# EAGLE design LightBox (EAGLE 9.2.2)
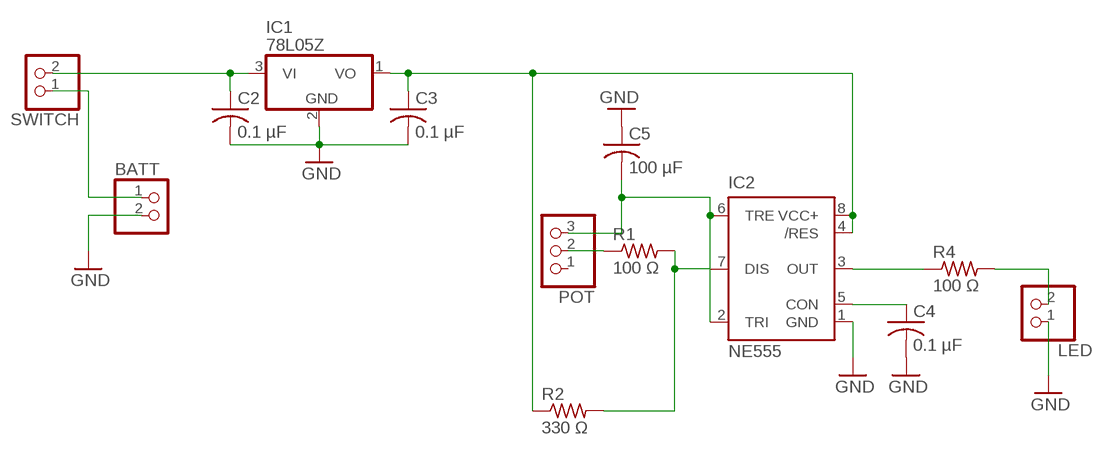
[diagram p0: schematic, sheet 1]

## Parts
BATT  PINHD-1X2  [1X02]
C2  0.1 µF  C-USC0805  [C0805]
C3  0.1 µF  C-USC0805  [C0805]
C4  0.1 µF  C-USC0805  [C0805]
C5  100 µF  C-US025-024X044  [C025-024X044]
IC1  78L05Z  [TO92]
IC2  NE555  [DIL-08]
LED  PINHD-1X2  [1X02]
POT  PINHD-1X3  [1X03]
R1  100 Ω  R-US_R0805  [R0805]
R2  330 Ω  R-US_R0805  [R0805]
R4  100 Ω  R-US_R0805  [R0805]
SWITCH  PINHD-1X2  [1X02]

## Nets
GND: BATT.2 C2.2 C3.2 C4.2 C5.1 IC1.2(GND) IC2.1(GND) LED.1
N$1: C5.2 IC2.2(TRI) IC2.6(TRE) POT.3
N$2: IC2.7(DIS) R1.2 R2.2
N$3: IC2.3(OUT) R4.1
N$4: LED.2 R4.2
N$5: C2.1 IC1.3(VI) SWITCH.2
N$6: C4.1 IC2.5(CON)
N$7: BATT.1 SWITCH.1
N$8: C3.1 IC1.1(VO) IC2.4(/RES) IC2.8(VCC+) R2.1
N$9: POT.2 R1.1
Unconnected: POT.1

## Library data of the parts
BATT LED SWITCH = pinhead:PINHD-1X2: PIN HEADER
C2-C5 = rcl:C-US: CAPACITOR, American symbol; SPICEPREFIX: C
IC1 = linear:78*: Positive VOLTAGE REGULATOR Source: http://cache.national.com/ds/LM/LM78L05.pdf http://www.fairchildsemi.com/ds/LM/LM7805.pdf
IC2 = st-microelectronics:NE555: General purpose bipolar Timer; MF: Arrow Electronics; MPN: NE555N; OC_FARNELL: 1467742; OC_NEWARK: 89K1486
POT = pinhead:PINHD-1X3: PIN HEADER
R1 R2 R4 = rcl:R-US_: RESISTOR, American symbol; SPICEPREFIX: R

## Board
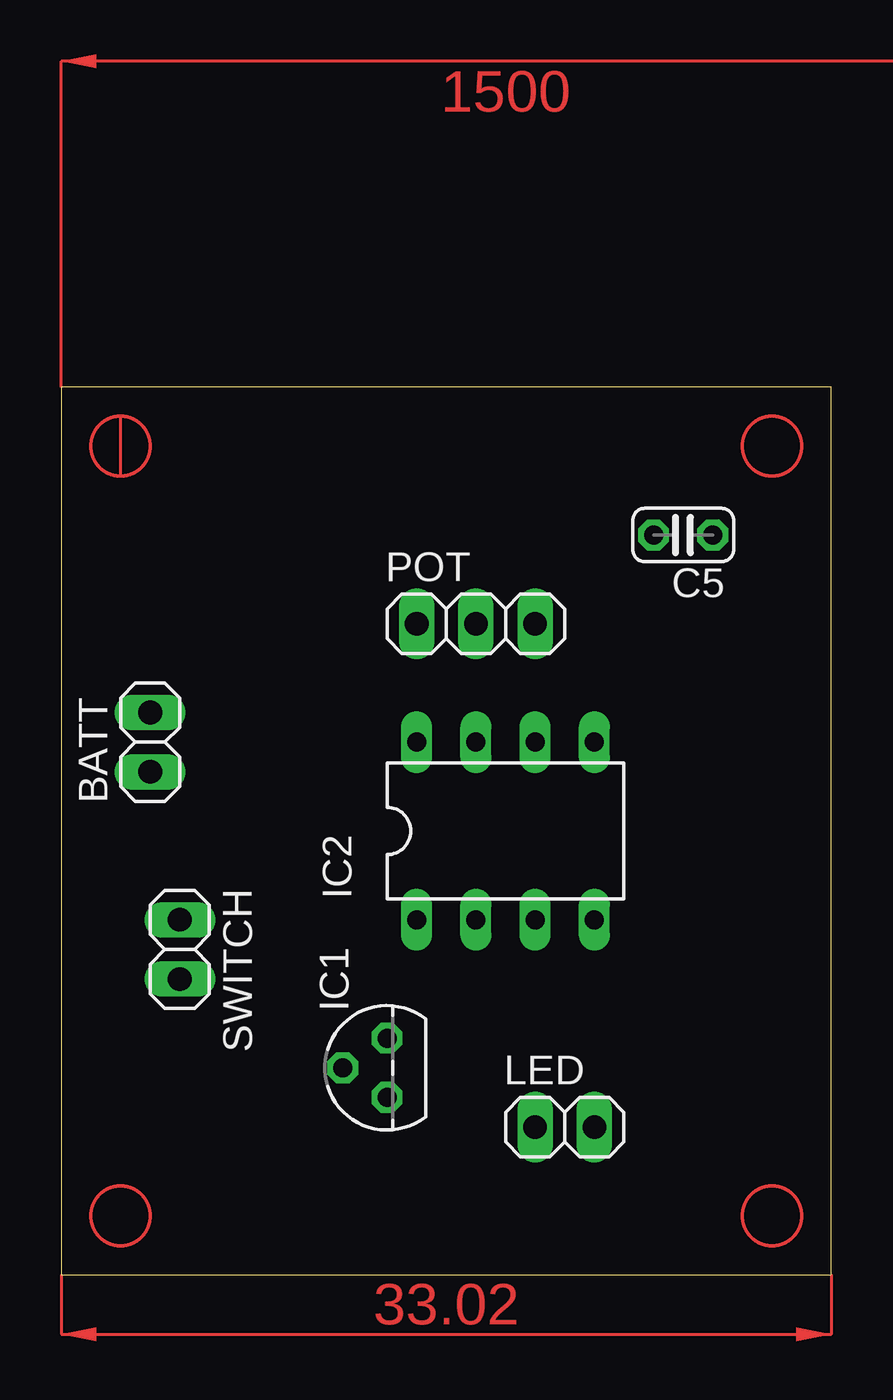
[diagram p1: board, top side]
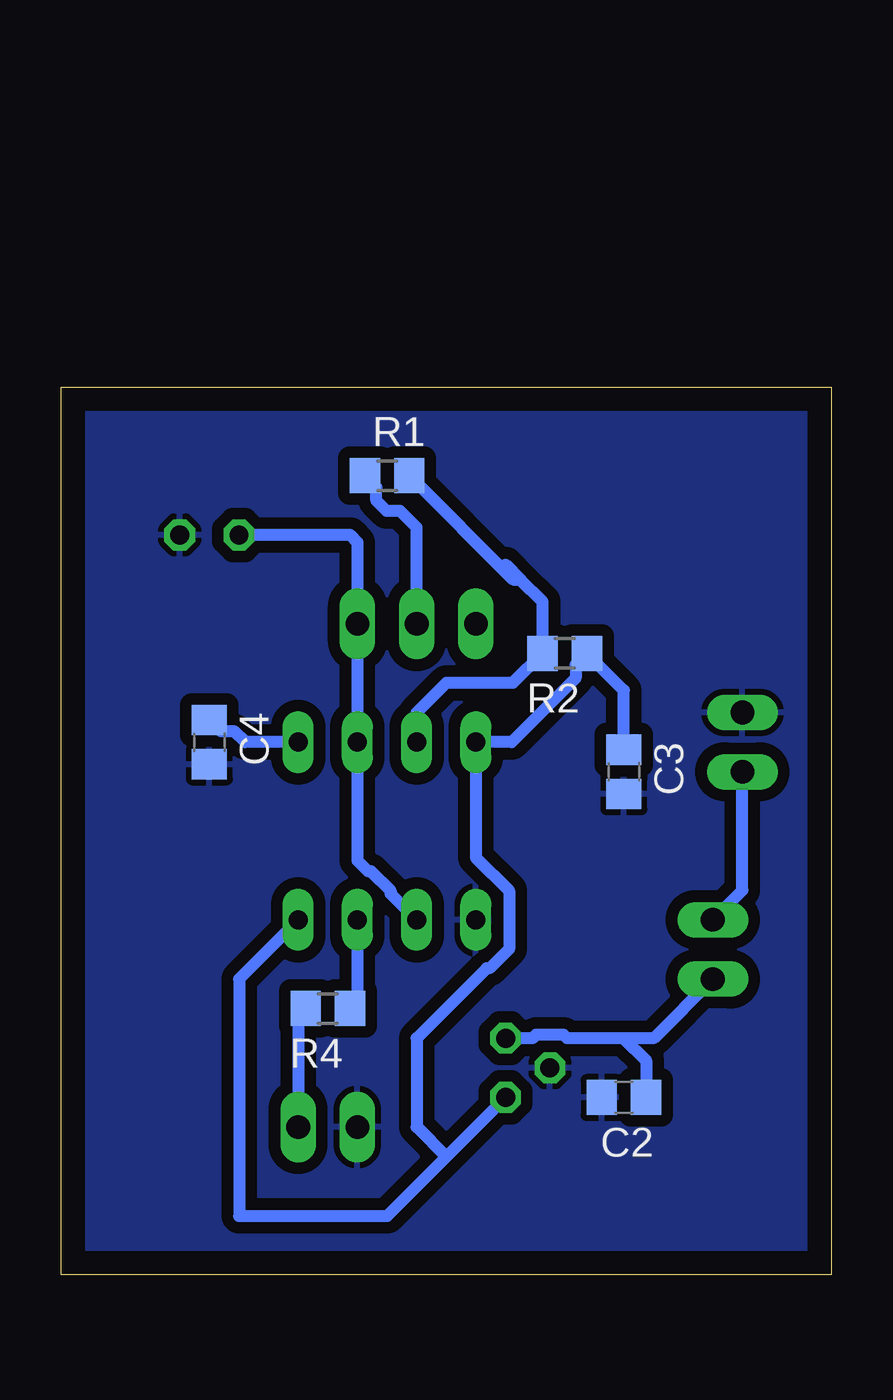
[diagram p2: board, bottom side, seen from below]

Size 33.02 x 38.1 mm. Coordinates in mm from the lower left corner, seen from the top.
Outline: 0,0 33.02,0 33.02,38.1 0,38.1 0,0
Copper layers (1*16): Top 0.035mm / dielectric 1.5mm / Bottom 0.035mm
Design rules "default *": minimum track width 20mil, minimum drill 0.35mm, track to track 20mil, track to pad 20mil, pad to pad 10mil, via to via 40mil, smd to smd 6mil, copper to edge 40mil, drill to drill 20mil, minimum pad ring 10mil, minimum via ring 8mil, stop-mask expansion 4mil, vias tented up to drill 0mil, thermal gap 10mil

### Footprints (pad centres in the part's own frame; a part is rotated, then mirrored left to right if it is on the bottom)
1X02 = drill 1.016 long: 1 -1.27,0; 2 1.27,0
C0805 = smd 1.3 x 1.5: 1 -0.95,0; 2 0.95,0
C025-024X044 = drill 0.813 octagon: 1 -1.27,0; 2 1.27,0
TO92 = drill 0.813 octagon: 1 -1.27,0; 2 0,1.905; 3 1.27,0
DIL-08 = drill 0.813 long: 1 -3.81,-3.81; 2 -1.27,-3.81; 3 1.27,-3.81; 4 3.81,-3.81; 5 3.81,3.81; 6 1.27,3.81; 7 -1.27,3.81; 8 -3.81,3.81
1X03 = drill 1.016 long: 1 -2.54,0; 2 0,0; 3 2.54,0
R0805 = smd 1.3 x 1.5: 1 -0.95,0; 2 0.95,0

### Placement (x,y rotation side)
BATT  3.81,22.86 90 top
C2  8.89,7.62 180 bottom
C3  8.89,21.59 270 bottom
C4  26.67,22.86 270 bottom
C5  26.67,31.75 180 top
IC1  13.97,8.89 90 top
IC2  19.05,19.05 0 top
LED  21.59,6.35 0 top
POT  17.78,27.94 0 top
R1  19.05,34.29 0 bottom
R2  11.43,26.67 180 bottom
R4  21.59,11.43 180 bottom
SWITCH  5.08,13.97 270 top

### Tracks (layer width: path | path; a pad name or v marks a point on that pad's centre or on a via)
GND
  pour Bottom: -2.54,40.64 -2.54,-2.54 40.64,-2.54 40.64,40.64
N$1
  Bottom 0.508: IC2.2 18.9,16.36 18.9,16.49 19.73,17.32 19.86,17.32 20.32,17.78 IC2.6 POT.3 20.32,31.43 20.64,31.75 C5.2
N$2
  Bottom 0.508: 13.97,30.48 13.34,29.84 | 13.34,29.84 12.38,28.89 R2.2 13.65,25.4 16.51,25.4 17.78,24.13 IC2.7 | R1.2 13.65,29.84 13.34,29.84
N$3
  Bottom 0.508: IC2.3 20.32,11.43 R4.1
N$4
  Bottom 0.508: R4.2 22.86,11.11 LED.2
N$5
  Bottom 0.508: 8.89,10.16 7.94,9.21 C2.1 | SWITCH.2 7.62,10.16 8.89,10.16 | 8.89,10.16 11.32,10.16 11.48,10.31 12.65,10.31 12.81,10.16 IC1.3
N$6
  Bottom 0.508: C4.1 26.18,23.32 25.6,23.32 25.14,22.86 IC2.5
N$7
  Bottom 0.508: SWITCH.1 3.81,16.51 BATT.1
N$8
  Bottom 0.508: C3.1 8.89,25.08 R2.1 10.97,26.18 10.97,25.6 13.71,22.86 IC2.8 15.24,17.91 13.82,16.49 13.82,13.99 14.65,13.16 14.78,13.16 17.78,10.16 17.78,6.35 16.51,5.08 | IC2.4 25.4,12.7 25.4,2.54 19.05,2.54 16.51,5.08 | IC1.1 16.51,5.08
N$9
  Bottom 0.508: POT.2 17.78,32.07 18.49,32.78 19.07,32.78 19.51,33.22 19.51,33.8 R1.1
(copper drawn outside any net)
  shapes: Top area x3, Top circle x4